# Altium schematic sheet TempSensor.SchDoc
size A4
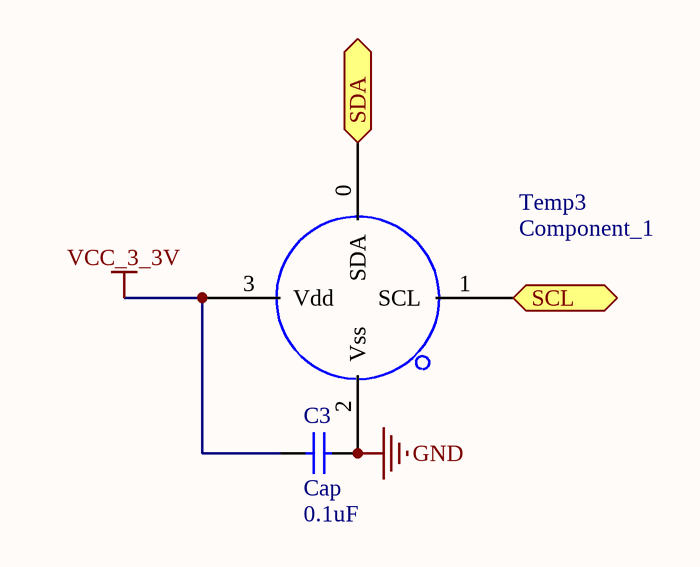
[diagram p0: TempSensor.SchDoc]

## Parts
C3  Cap  value 0.1uF  [R0805]
Temp3  Component_1  [MLX90614]

## Ports
SCL (in), SDA (bidir)

## Nets
GND: C3.2 Temp3.2(Vss)
VCC_3_3V: C3.1 Temp3.3(Vdd)
SCL: Temp3.1(SCL) ; port SCL
SDA: Temp3.0(SDA) ; port SDA

## Library data of the parts
C3 = Cap: Capacitor; Published: 8-Jun-2000; LatestRevisionDate: 17-Jul-2002; LatestRevisionNote: Re-released for DXP Platform.; PackageReference: RAD-0.3; Publisher: Altium Limited; PackageDescription: Radial Cap, Thru-Hole; 2 Leads; 0.3 in Pin Spacing